# EAGLE design AniBike_v2.5_SecondaryBoard (EAGLE 5.08)

## Sheet 1 of 2
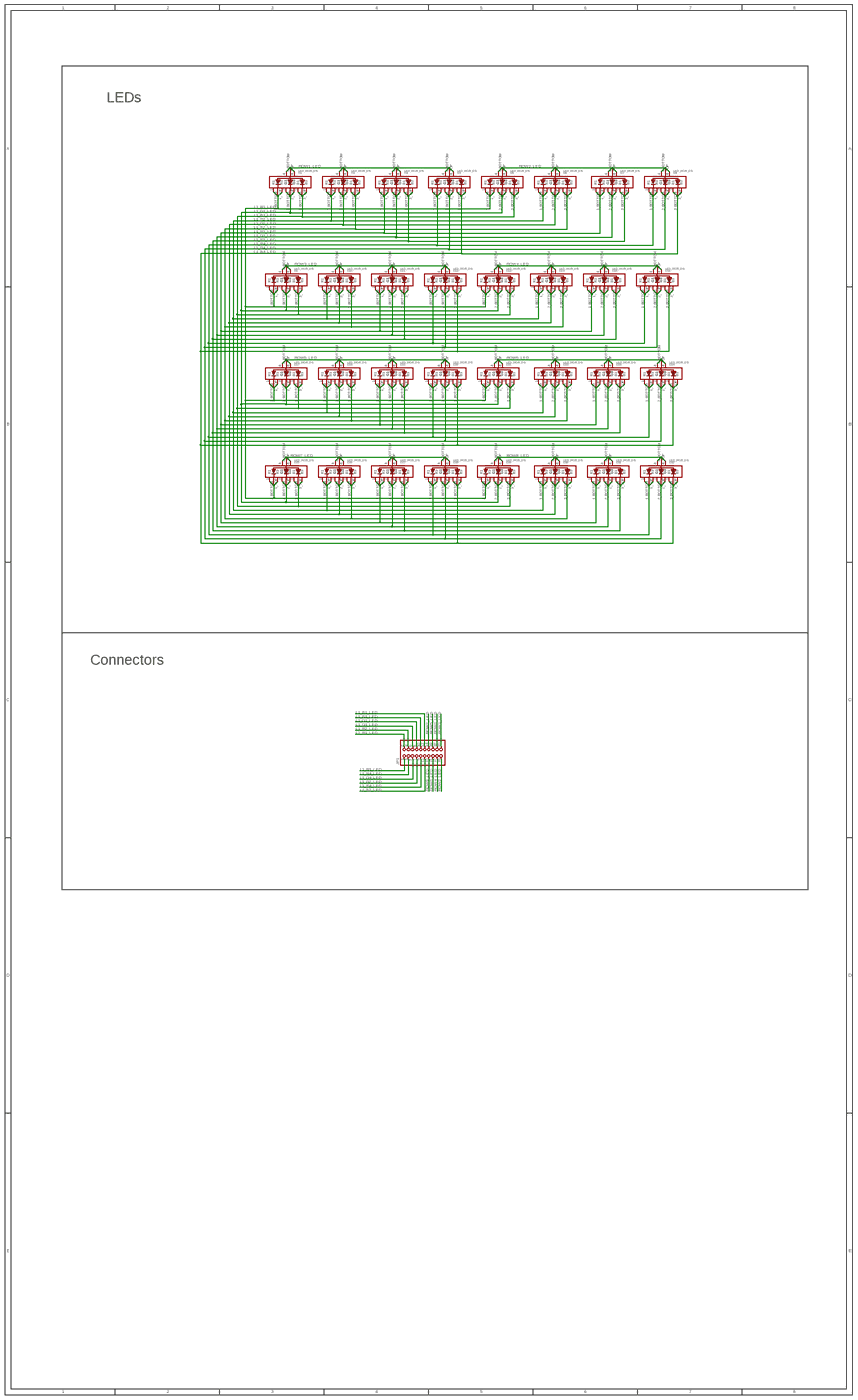
[diagram p0: schematic, sheet 1, overview]
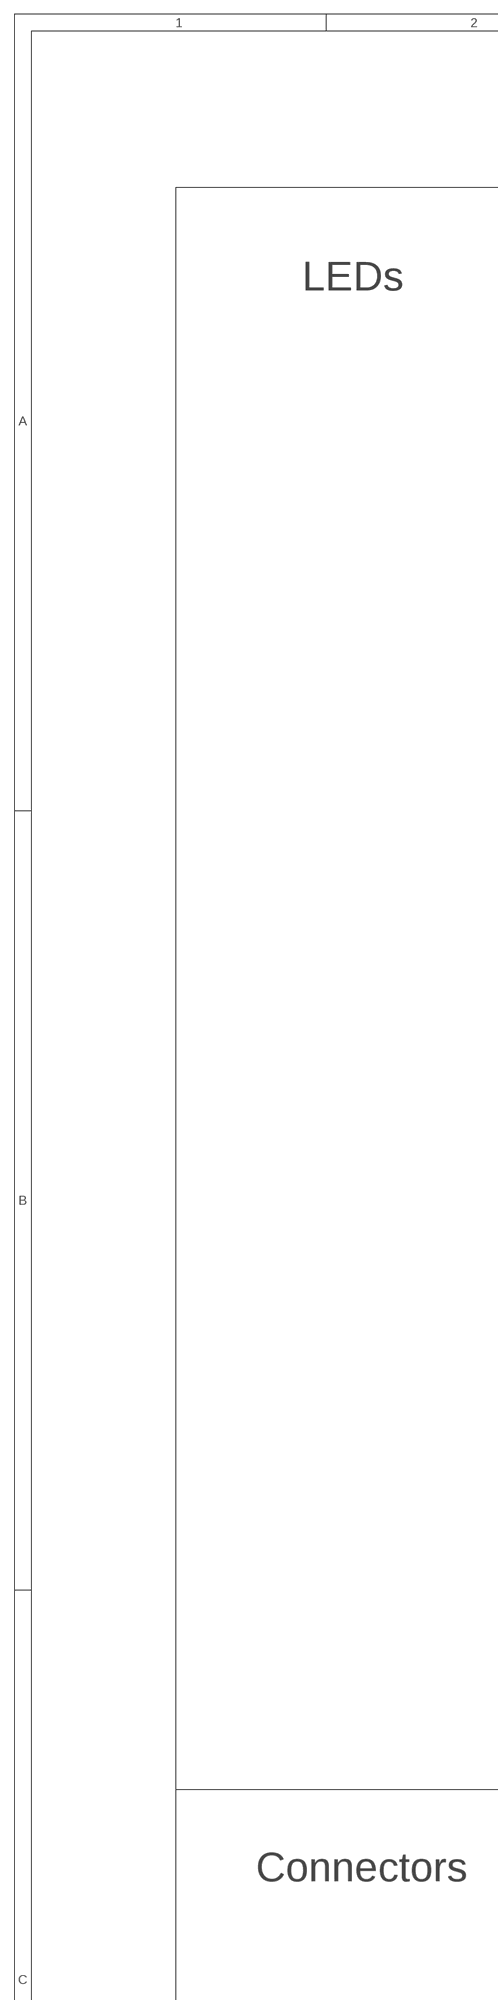
[diagram p1: schematic, sheet 1, part 1 of 4]
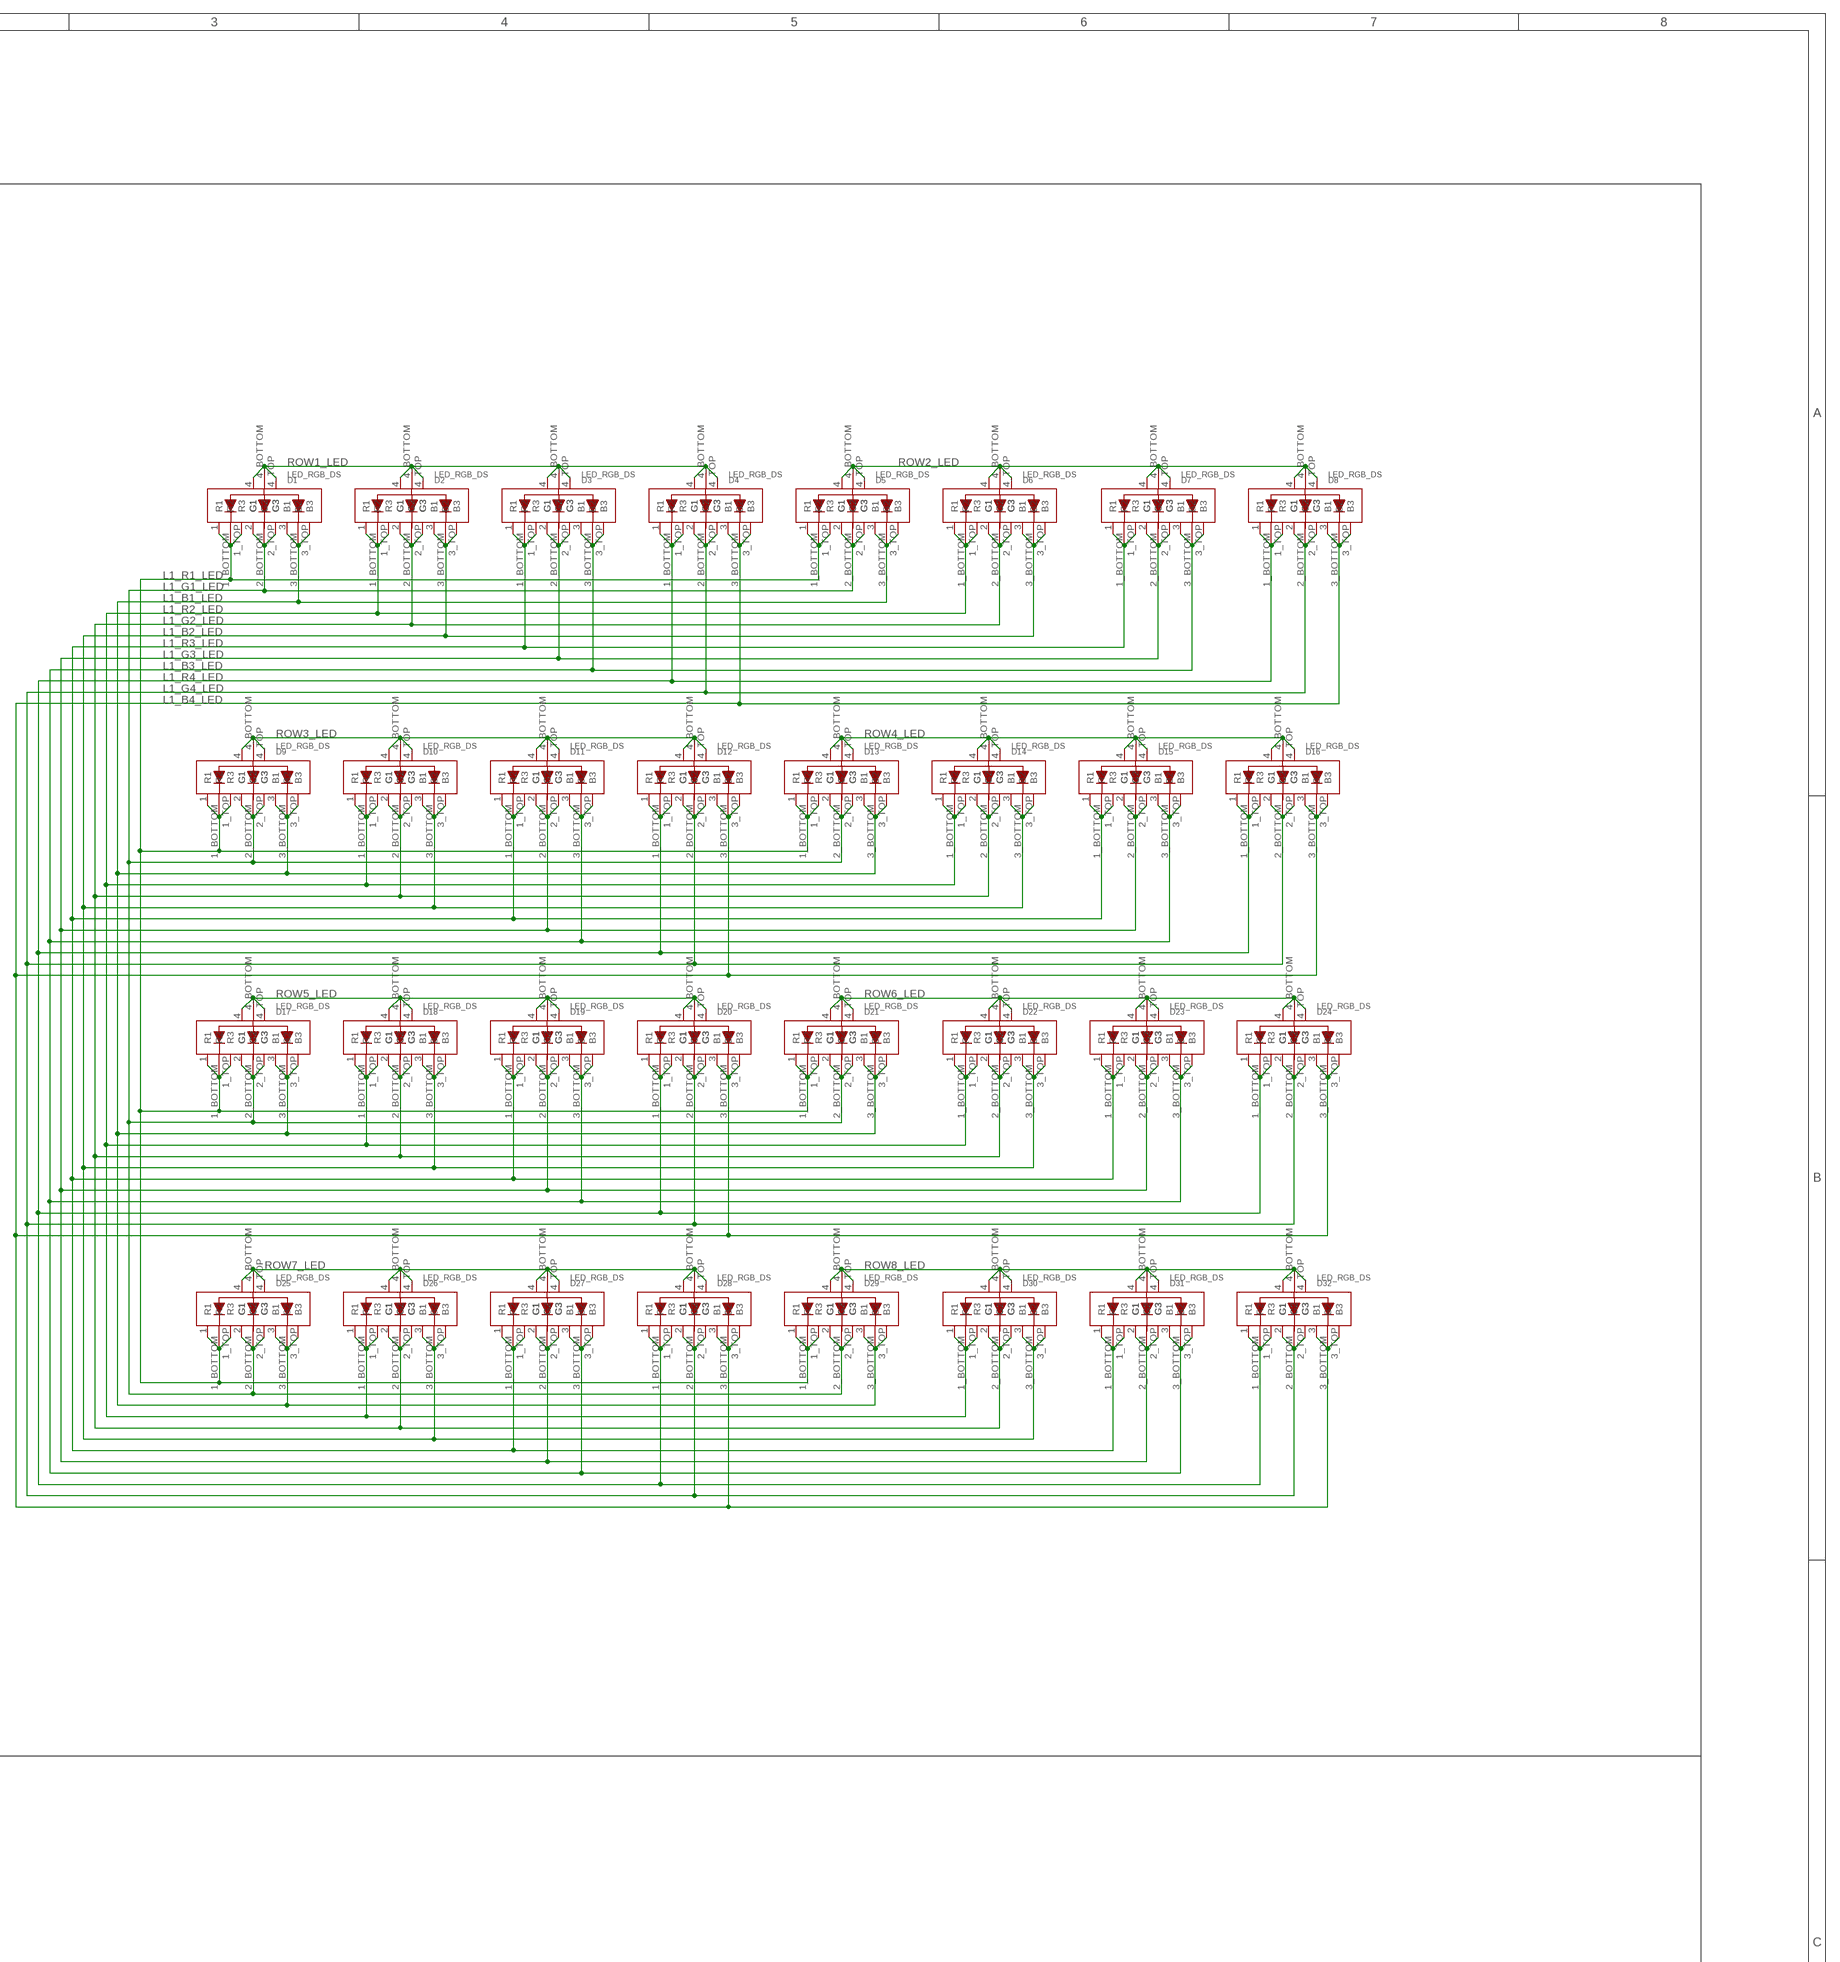
[diagram p2: schematic, sheet 1, part 2 of 4]
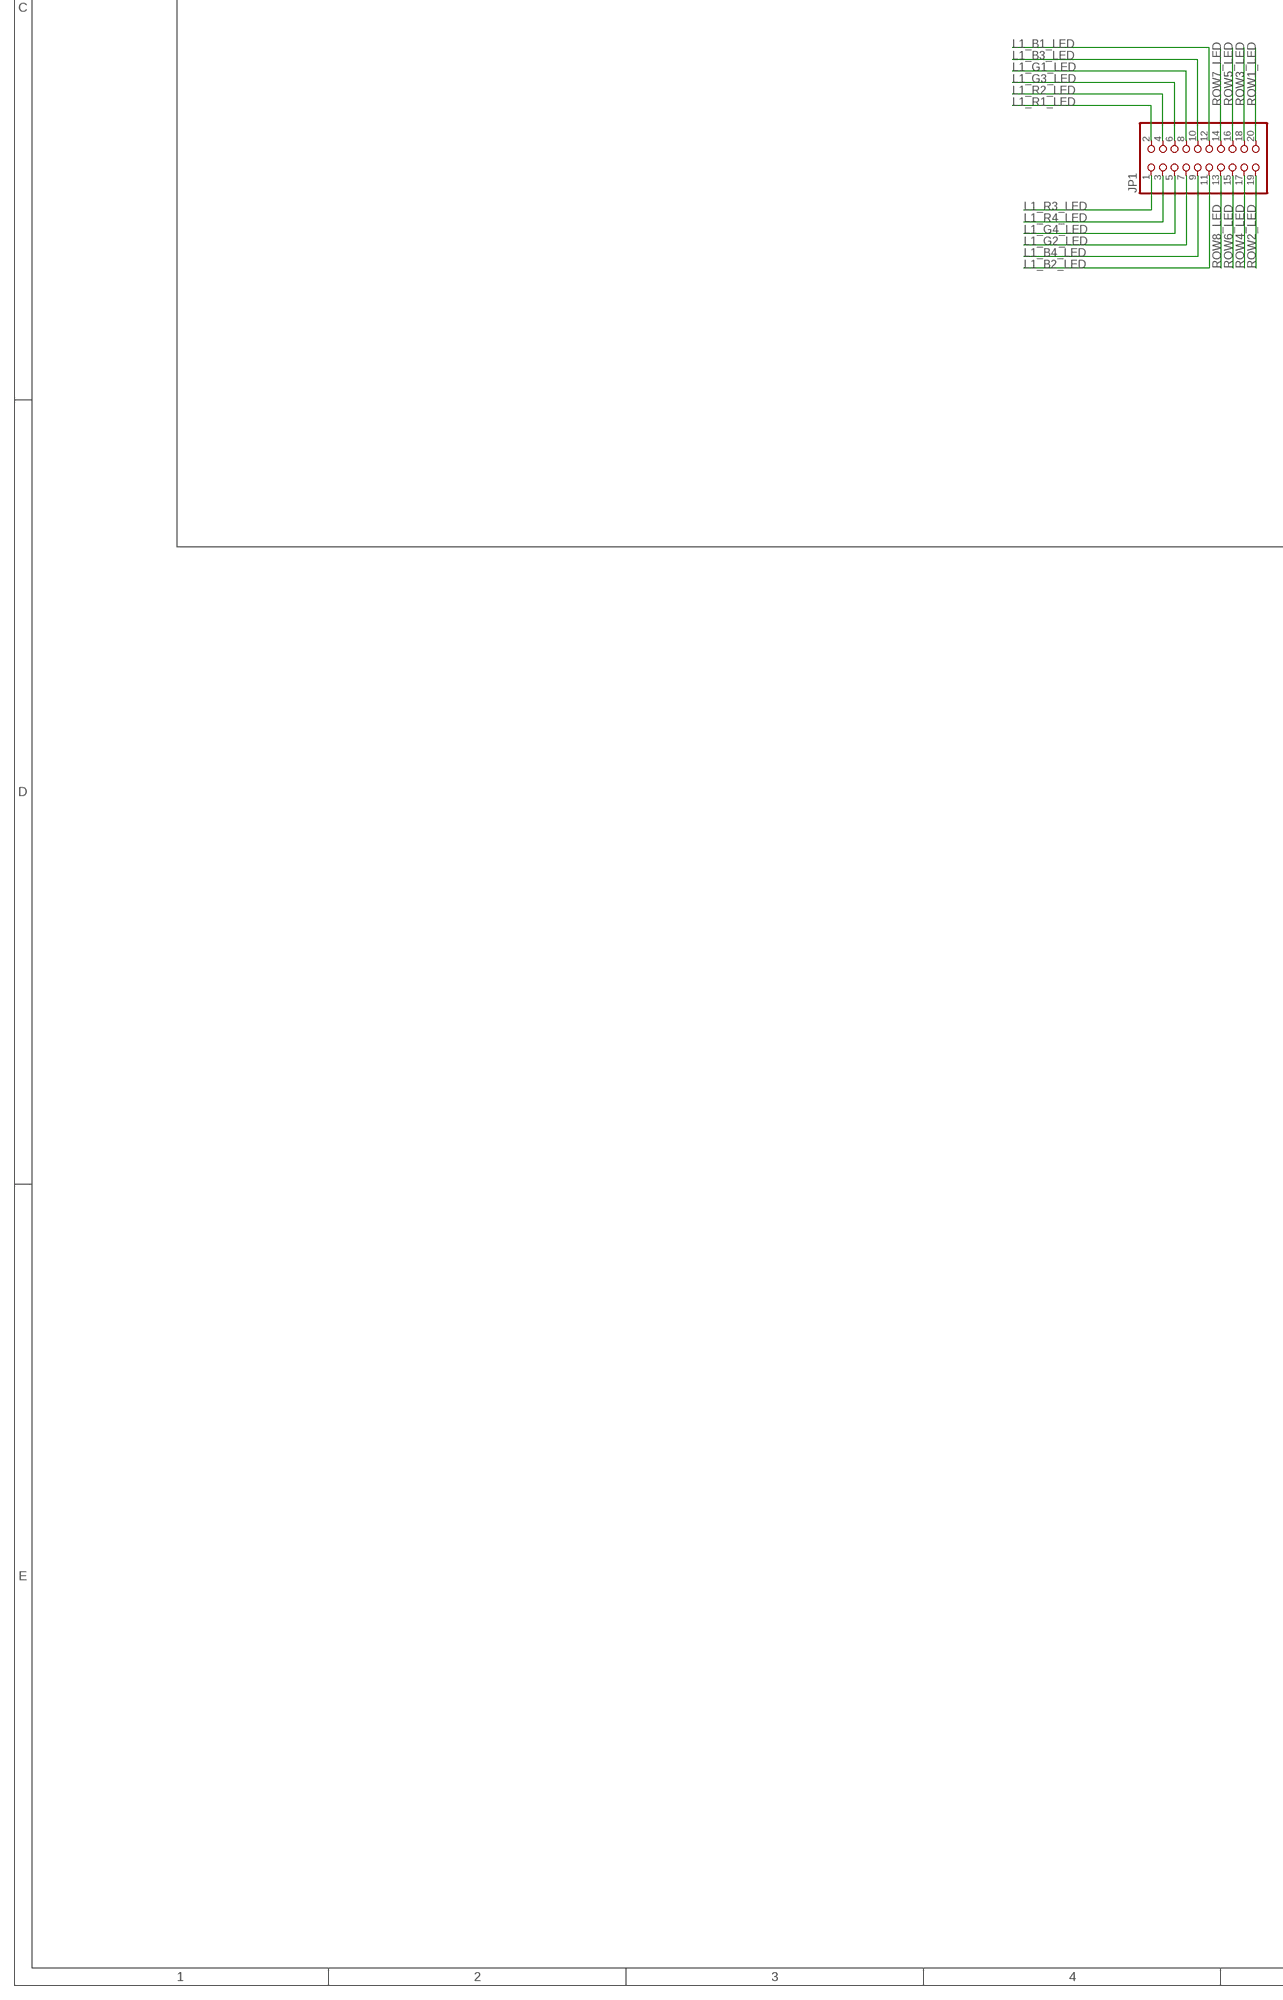
[diagram p3: schematic, sheet 1, part 3 of 4]
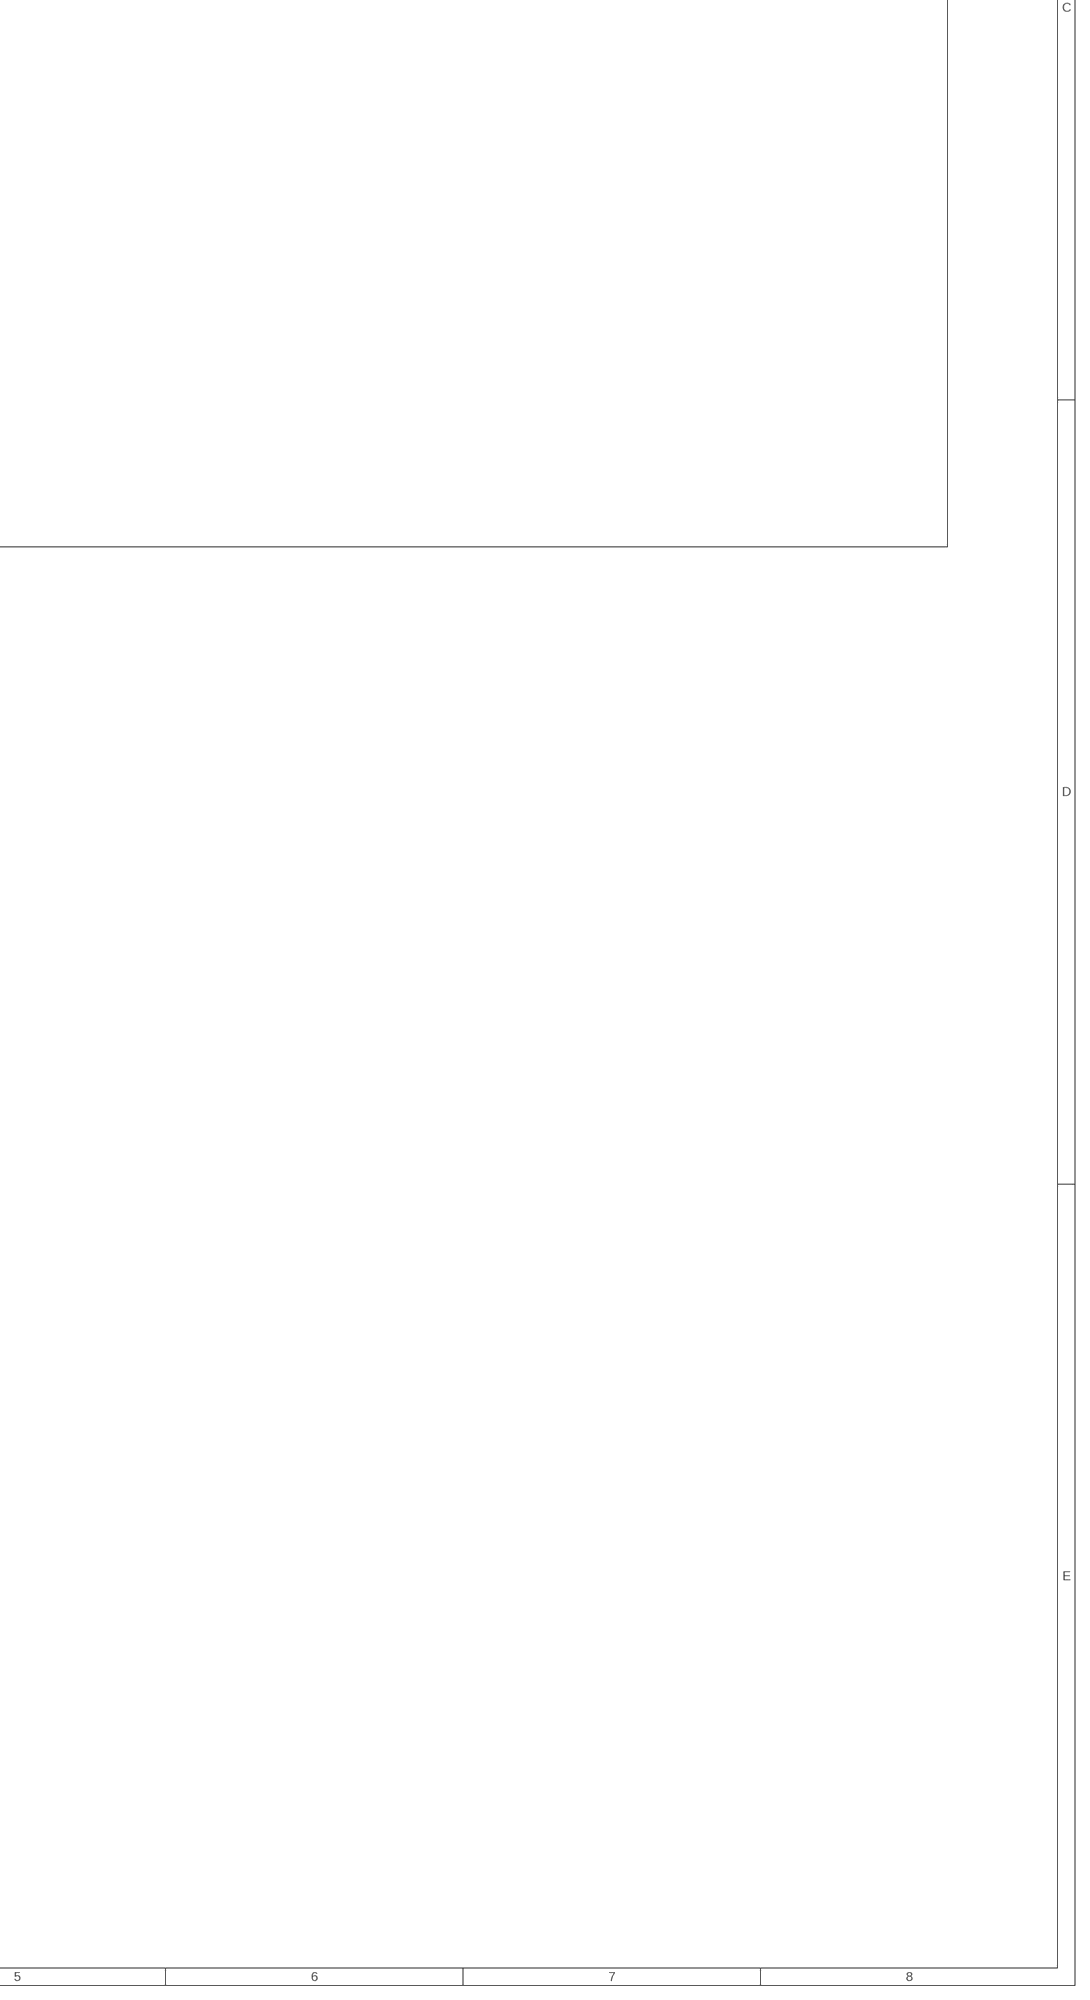
[diagram p4: schematic, sheet 1, part 4 of 4]

### Parts
D1  LED_RGB_DS  [LED1210_DS]
D2  LED_RGB_DS  [LED1210_DS]
D3  LED_RGB_DS  [LED1210_DS]
D4  LED_RGB_DS  [LED1210_DS]
D5  LED_RGB_DS  [LED1210_DS]
D6  LED_RGB_DS  [LED1210_DS]
D7  LED_RGB_DS  [LED1210_DS]
D8  LED_RGB_DS  [LED1210_DS]
D9  LED_RGB_DS  [LED1210_DS]
D10  LED_RGB_DS  [LED1210_DS]
D11  LED_RGB_DS  [LED1210_DS]
D12  LED_RGB_DS  [LED1210_DS]
D13  LED_RGB_DS  [LED1210_DS]
D14  LED_RGB_DS  [LED1210_DS]
D15  LED_RGB_DS  [LED1210_DS]
D16  LED_RGB_DS  [LED1210_DS]
D17  LED_RGB_DS  [LED1210_DS]
D18  LED_RGB_DS  [LED1210_DS]
D19  LED_RGB_DS  [LED1210_DS]
D20  LED_RGB_DS  [LED1210_DS]
D21  LED_RGB_DS  [LED1210_DS]
D22  LED_RGB_DS  [LED1210_DS]
D23  LED_RGB_DS  [LED1210_DS]
D24  LED_RGB_DS  [LED1210_DS]
D25  LED_RGB_DS  [LED1210_DS]
D26  LED_RGB_DS  [LED1210_DS]
D27  LED_RGB_DS  [LED1210_DS]
D28  LED_RGB_DS  [LED1210_DS]
D29  LED_RGB_DS  [LED1210_DS]
D30  LED_RGB_DS  [LED1210_DS]
D31  LED_RGB_DS  [LED1210_DS]
D32  LED_RGB_DS  [LED1210_DS]
JP1  PINHD-2X10  [2X10]

### Nets
L1_B1_LED: D1.3(B1) D1.3_BOTTOM(B2) D1.3_TOP(B3) D5.3(B1) D5.3_BOTTOM(B2) D5.3_TOP(B3) D9.3(B1) D9.3_BOTTOM(B2) D9.3_TOP(B3) D13.3(B1) D13.3_BOTTOM(B2) D13.3_TOP(B3) D17.3(B1) D17.3_BOTTOM(B2) D17.3_TOP(B3) D21.3(B1) D21.3_BOTTOM(B2) D21.3_TOP(B3) D25.3(B1) D25.3_BOTTOM(B2) D25.3_TOP(B3) D29.3(B1) D29.3_BOTTOM(B2) D29.3_TOP(B3) JP1.12
L1_B2_LED: D2.3(B1) D2.3_BOTTOM(B2) D2.3_TOP(B3) D6.3(B1) D6.3_BOTTOM(B2) D6.3_TOP(B3) D10.3(B1) D10.3_BOTTOM(B2) D10.3_TOP(B3) D14.3(B1) D14.3_BOTTOM(B2) D14.3_TOP(B3) D18.3(B1) D18.3_BOTTOM(B2) D18.3_TOP(B3) D22.3(B1) D22.3_BOTTOM(B2) D22.3_TOP(B3) D26.3(B1) D26.3_BOTTOM(B2) D26.3_TOP(B3) D30.3(B1) D30.3_BOTTOM(B2) D30.3_TOP(B3) JP1.11
L1_B3_LED: D3.3(B1) D3.3_BOTTOM(B2) D3.3_TOP(B3) D7.3(B1) D7.3_BOTTOM(B2) D7.3_TOP(B3) D11.3(B1) D11.3_BOTTOM(B2) D11.3_TOP(B3) D15.3(B1) D15.3_BOTTOM(B2) D15.3_TOP(B3) D19.3(B1) D19.3_BOTTOM(B2) D19.3_TOP(B3) D23.3(B1) D23.3_BOTTOM(B2) D23.3_TOP(B3) D27.3(B1) D27.3_BOTTOM(B2) D27.3_TOP(B3) D31.3(B1) D31.3_BOTTOM(B2) D31.3_TOP(B3) JP1.10
L1_B4_LED: D4.3(B1) D4.3_BOTTOM(B2) D4.3_TOP(B3) D8.3(B1) D8.3_BOTTOM(B2) D8.3_TOP(B3) D12.3(B1) D12.3_BOTTOM(B2) D12.3_TOP(B3) D16.3(B1) D16.3_BOTTOM(B2) D16.3_TOP(B3) D20.3(B1) D20.3_BOTTOM(B2) D20.3_TOP(B3) D24.3(B1) D24.3_BOTTOM(B2) D24.3_TOP(B3) D28.3(B1) D28.3_BOTTOM(B2) D28.3_TOP(B3) D32.3(B1) D32.3_BOTTOM(B2) D32.3_TOP(B3) JP1.9
L1_G1_LED: D1.2(G1) D1.2_BOTTOM(G2) D1.2_TOP(G3) D5.2(G1) D5.2_BOTTOM(G2) D5.2_TOP(G3) D9.2(G1) D9.2_BOTTOM(G2) D9.2_TOP(G3) D13.2(G1) D13.2_BOTTOM(G2) D13.2_TOP(G3) D17.2(G1) D17.2_BOTTOM(G2) D17.2_TOP(G3) D21.2(G1) D21.2_BOTTOM(G2) D21.2_TOP(G3) D25.2(G1) D25.2_BOTTOM(G2) D25.2_TOP(G3) D29.2(G1) D29.2_BOTTOM(G2) D29.2_TOP(G3) JP1.8
L1_G2_LED: D2.2(G1) D2.2_BOTTOM(G2) D2.2_TOP(G3) D6.2(G1) D6.2_BOTTOM(G2) D6.2_TOP(G3) D10.2(G1) D10.2_BOTTOM(G2) D10.2_TOP(G3) D14.2(G1) D14.2_BOTTOM(G2) D14.2_TOP(G3) D18.2(G1) D18.2_BOTTOM(G2) D18.2_TOP(G3) D22.2(G1) D22.2_BOTTOM(G2) D22.2_TOP(G3) D26.2(G1) D26.2_BOTTOM(G2) D26.2_TOP(G3) D30.2(G1) D30.2_BOTTOM(G2) D30.2_TOP(G3) JP1.7
L1_G3_LED: D3.2(G1) D3.2_BOTTOM(G2) D3.2_TOP(G3) D7.2(G1) D7.2_BOTTOM(G2) D7.2_TOP(G3) D11.2(G1) D11.2_BOTTOM(G2) D11.2_TOP(G3) D15.2(G1) D15.2_BOTTOM(G2) D15.2_TOP(G3) D19.2(G1) D19.2_BOTTOM(G2) D19.2_TOP(G3) D23.2(G1) D23.2_BOTTOM(G2) D23.2_TOP(G3) D27.2(G1) D27.2_BOTTOM(G2) D27.2_TOP(G3) D31.2(G1) D31.2_BOTTOM(G2) D31.2_TOP(G3) JP1.6
L1_G4_LED: D4.2(G1) D4.2_BOTTOM(G2) D4.2_TOP(G3) D8.2(G1) D8.2_BOTTOM(G2) D8.2_TOP(G3) D12.2(G1) D12.2_BOTTOM(G2) D12.2_TOP(G3) D16.2(G1) D16.2_BOTTOM(G2) D16.2_TOP(G3) D20.2(G1) D20.2_BOTTOM(G2) D20.2_TOP(G3) D24.2(G1) D24.2_BOTTOM(G2) D24.2_TOP(G3) D28.2(G1) D28.2_BOTTOM(G2) D28.2_TOP(G3) D32.2(G1) D32.2_BOTTOM(G2) D32.2_TOP(G3) JP1.5
L1_R1_LED: D1.1(R1) D1.1_BOTTOM(R2) D1.1_TOP(R3) D5.1(R1) D5.1_BOTTOM(R2) D5.1_TOP(R3) D9.1(R1) D9.1_BOTTOM(R2) D9.1_TOP(R3) D13.1(R1) D13.1_BOTTOM(R2) D13.1_TOP(R3) D17.1(R1) D17.1_BOTTOM(R2) D17.1_TOP(R3) D21.1(R1) D21.1_BOTTOM(R2) D21.1_TOP(R3) D25.1(R1) D25.1_BOTTOM(R2) D25.1_TOP(R3) D29.1(R1) D29.1_BOTTOM(R2) D29.1_TOP(R3) JP1.2
L1_R2_LED: D2.1(R1) D2.1_BOTTOM(R2) D2.1_TOP(R3) D6.1(R1) D6.1_BOTTOM(R2) D6.1_TOP(R3) D10.1(R1) D10.1_BOTTOM(R2) D10.1_TOP(R3) D14.1(R1) D14.1_BOTTOM(R2) D14.1_TOP(R3) D18.1(R1) D18.1_BOTTOM(R2) D18.1_TOP(R3) D22.1(R1) D22.1_BOTTOM(R2) D22.1_TOP(R3) D26.1(R1) D26.1_BOTTOM(R2) D26.1_TOP(R3) D30.1(R1) D30.1_BOTTOM(R2) D30.1_TOP(R3) JP1.4
L1_R3_LED: D3.1(R1) D3.1_BOTTOM(R2) D3.1_TOP(R3) D7.1(R1) D7.1_BOTTOM(R2) D7.1_TOP(R3) D11.1(R1) D11.1_BOTTOM(R2) D11.1_TOP(R3) D15.1(R1) D15.1_BOTTOM(R2) D15.1_TOP(R3) D19.1(R1) D19.1_BOTTOM(R2) D19.1_TOP(R3) D23.1(R1) D23.1_BOTTOM(R2) D23.1_TOP(R3) D27.1(R1) D27.1_BOTTOM(R2) D27.1_TOP(R3) D31.1(R1) D31.1_BOTTOM(R2) D31.1_TOP(R3) JP1.1
L1_R4_LED: D4.1(R1) D4.1_BOTTOM(R2) D4.1_TOP(R3) D8.1(R1) D8.1_BOTTOM(R2) D8.1_TOP(R3) D12.1(R1) D12.1_BOTTOM(R2) D12.1_TOP(R3) D16.1(R1) D16.1_BOTTOM(R2) D16.1_TOP(R3) D20.1(R1) D20.1_BOTTOM(R2) D20.1_TOP(R3) D24.1(R1) D24.1_BOTTOM(R2) D24.1_TOP(R3) D28.1(R1) D28.1_BOTTOM(R2) D28.1_TOP(R3) D32.1(R1) D32.1_BOTTOM(R2) D32.1_TOP(R3) JP1.3
ROW1_LED: D1.4(C1) D1.4_BOTTOM(C2) D1.4_TOP(C3) D2.4(C1) D2.4_BOTTOM(C2) D2.4_TOP(C3) D3.4(C1) D3.4_BOTTOM(C2) D3.4_TOP(C3) D4.4(C1) D4.4_BOTTOM(C2) D4.4_TOP(C3) JP1.20
ROW2_LED: D5.4(C1) D5.4_BOTTOM(C2) D5.4_TOP(C3) D6.4(C1) D6.4_BOTTOM(C2) D6.4_TOP(C3) D7.4(C1) D7.4_BOTTOM(C2) D7.4_TOP(C3) D8.4(C1) D8.4_BOTTOM(C2) D8.4_TOP(C3) JP1.19
ROW3_LED: D9.4(C1) D9.4_BOTTOM(C2) D9.4_TOP(C3) D10.4(C1) D10.4_BOTTOM(C2) D10.4_TOP(C3) D11.4(C1) D11.4_BOTTOM(C2) D11.4_TOP(C3) D12.4(C1) D12.4_BOTTOM(C2) D12.4_TOP(C3) JP1.18
ROW4_LED: D13.4(C1) D13.4_BOTTOM(C2) D13.4_TOP(C3) D14.4(C1) D14.4_BOTTOM(C2) D14.4_TOP(C3) D15.4(C1) D15.4_BOTTOM(C2) D15.4_TOP(C3) D16.4(C1) D16.4_BOTTOM(C2) D16.4_TOP(C3) JP1.17
ROW5_LED: D17.4(C1) D17.4_BOTTOM(C2) D17.4_TOP(C3) D18.4(C1) D18.4_BOTTOM(C2) D18.4_TOP(C3) D19.4(C1) D19.4_BOTTOM(C2) D19.4_TOP(C3) D20.4(C1) D20.4_BOTTOM(C2) D20.4_TOP(C3) JP1.16
ROW6_LED: D21.4(C1) D21.4_BOTTOM(C2) D21.4_TOP(C3) D22.4(C1) D22.4_BOTTOM(C2) D22.4_TOP(C3) D23.4(C1) D23.4_BOTTOM(C2) D23.4_TOP(C3) D24.4(C1) D24.4_BOTTOM(C2) D24.4_TOP(C3) JP1.15
ROW7_LED: D25.4(C1) D25.4_BOTTOM(C2) D25.4_TOP(C3) D26.4(C1) D26.4_BOTTOM(C2) D26.4_TOP(C3) D27.4(C1) D27.4_BOTTOM(C2) D27.4_TOP(C3) D28.4(C1) D28.4_BOTTOM(C2) D28.4_TOP(C3) JP1.14
ROW8_LED: D29.4(C1) D29.4_BOTTOM(C2) D29.4_TOP(C3) D30.4(C1) D30.4_BOTTOM(C2) D30.4_TOP(C3) D31.4(C1) D31.4_BOTTOM(C2) D31.4_TOP(C3) D32.4(C1) D32.4_BOTTOM(C2) D32.4_TOP(C3) JP1.13

### Notes on the sheet
- LEDs
- Connectors

## Sheet 2 of 2

## Library data of the parts
D1-D32 = AniBike_Common_Library:LED_RGB_DS
JP1 = SparkFun:PINHD-2X10: PIN HEADER

## Board
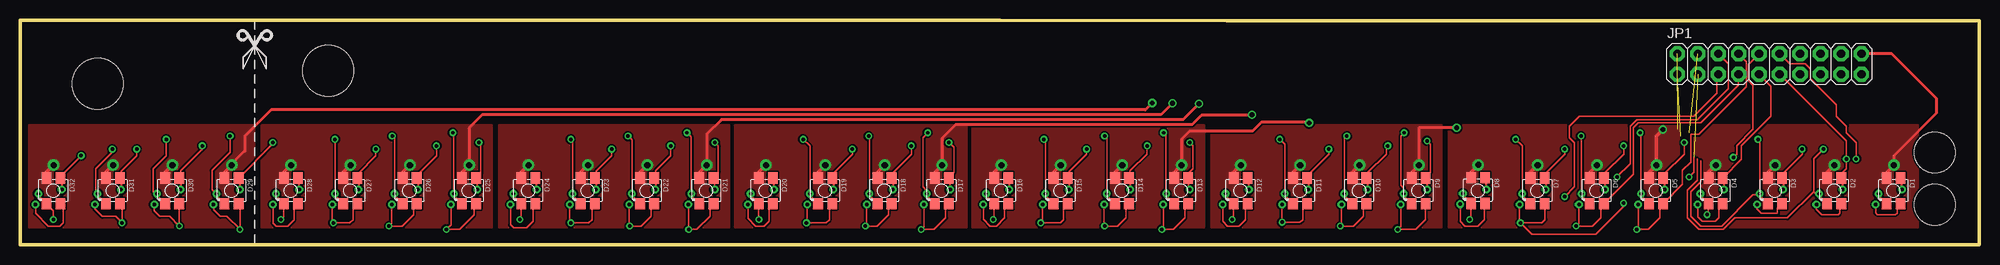
[diagram p5: board, top side]
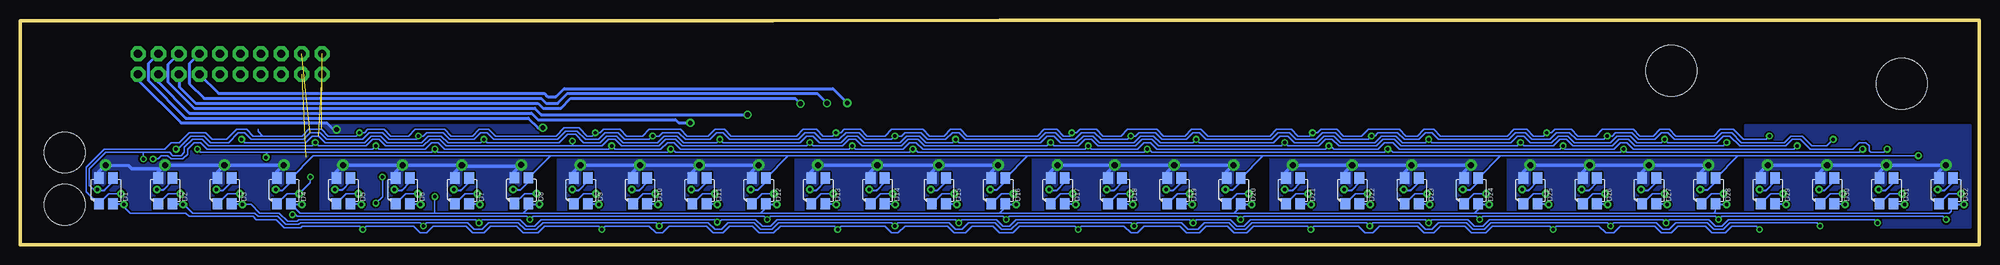
[diagram p6: board, bottom side, seen from below]

Size 243.13 x 27.84 mm. Coordinates in mm from the lower left corner, seen from the top.
Outline: 243.13,0 0,0 0,27.84 121.56,27.84 149.71,27.74 243.13,27.74 243.13,0
Copper layers (1*16): Top 0.035mm / dielectric 1.5mm / Bottom 0.035mm
Design rules "default *": minimum track width 7mil, minimum drill 15mil, track to track 8mil, track to pad 8mil, pad to pad 8mil, via to via 8mil, smd to smd 8mil, copper to edge 10mil, drill to drill 15mil, minimum pad ring 10mil, minimum via ring 8mil, stop-mask expansion 4mil, vias tented up to drill 0mil, thermal gap 10mil
Holes 6.35 mm at 9.6,19.96 38.25,21.59
Holes 5.08 mm at 237.59,4.93 237.59,11.43

### Footprints (pad centres in the part's own frame; a part is rotated, then mirrored left to right if it is on the bottom)
LED1210_DS = drill 0.432 pad 0.889 round: 1 -1.913,-0.353; 2 -2.25,-1.68; 3 1,0.15 | smd 1.2 x 1.4 bottom: 1_BOTTOM 0.85,-1.6; 2_BOTTOM -0.9,-1.6; 3_BOTTOM -0.9,1.6; 4_BOTTOM 0.85,1.6 | smd 1.2 x 1.4: 1_TOP -0.9,-1.6; 2_TOP 0.85,-1.6; 3_TOP 0.85,1.6; 4_TOP -0.9,1.6 | drill 0.762 pad 1.422 round: 4 0,3.2
2X10 = drill 1.016 pad 1.88 octagon: 1 -11.43,-1.27; 2 -11.43,1.27; 3 -8.89,-1.27; 4 -8.89,1.27; 5 -6.35,-1.27; 6 -6.35,1.27; 7 -3.81,-1.27; 8 -3.81,1.27; 9 -1.27,-1.27; 10 -1.27,1.27; 11 1.27,-1.27; 12 1.27,1.27; 13 3.81,-1.27; 14 3.81,1.27; 15 6.35,-1.27; 16 6.35,1.27; 17 8.89,-1.27; 18 8.89,1.27; 19 11.43,-1.27; 20 11.43,1.27

### Placement (x,y rotation side)
D1  232.51,6.65 0 top
D2  225.15,6.65 0 top
D3  217.78,6.65 0 top
D4  210.41,6.65 0 top
D5  203.05,6.65 0 top
D6  195.68,6.65 0 top
D7  188.32,6.65 0 top
D8  180.95,6.68 0 top
D9  173.58,6.65 0 top
D10  166.22,6.65 0 top
D11  158.85,6.65 0 top
D12  151.49,6.65 0 top
D13  144.12,6.65 0 top
D14  136.75,6.65 0 top
D15  129.13,6.65 0 top
D16  121.77,6.65 0 top
D17  114.4,6.65 0 top
D18  107.29,6.65 0 top
D19  99.92,6.65 0 top
D20  92.56,6.65 0 top
D21  85.19,6.65 0 top
D22  77.83,6.65 0 top
D23  70.46,6.65 0 top
D24  63.09,6.65 0 top
D25  55.73,6.65 0 top
D26  48.36,6.65 0 top
D27  41,6.65 0 top
D28  33.63,6.65 0 top
D29  26.26,6.65 0 top
D30  18.9,6.65 0 top
D31  11.53,6.65 0 top
D32  4.17,6.65 0 top
JP1  217.07,22.4 0 top

### Tracks (layer width: path | path; a pad name or v marks a point on that pad's centre or on a via)
L1_B1_LED  (via drill 0.43)
  Top 0.203: 204.05,8.1 204.05,8.77 206.5,11.23 v206.5,12.65 | D29.3_TOP 31.34,12.48 v31.34,12.65 | v56.95,12.65 57.15,12.45 57.15,8.79 56.62,8.25 D25.3_TOP 56.73,8.1 D25.3 | v86.21,12.65 86.61,12.24 86.61,8.99 86.04,8.42 D21.3_TOP 86.19,8.1 D21.3 | v115.26,12.65 115.87,12.04 115.87,8.99 115.25,8.37 D17.3_TOP 115.4,8.1 D17.3 | v145.14,12.65 145.54,12.24 145.54,9.4 144.97,8.83 D13.3_TOP 144.97,6.95 D13.3 | v174.6,12.85 175.01,12.45 175.01,8.99 174.43,8.42 D9.3_TOP | D1.3_TOP 233.4,8.25 | v227.84,10.62 227.84,12.65 226.62,13.87 226.62,14.68 225.4,15.9 225.4,17.32 222.15,20.57 222.15,21.79 221.54,22.4 219.61,22.4 JP1.12
  Top 0.254: D1.3 233.51,8.1 D1.3_TOP | D5.3 204.05,8.1 D5.3_TOP | D9.3 174.58,8.1 D9.3_TOP | D29.3_TOP 27.26,8.1 D29.3
  Bottom 0.203: v31.34,12.65 31.75,12.24 42.72,12.24 43.54,13.06 44.75,13.06 45.57,12.24 50.44,12.24 51.26,13.06 52.07,13.06 52.88,12.24 56.54,12.24 v56.95,12.65 57.35,12.24 71.78,12.24 72.59,13.06 74.02,13.06 74.83,12.24 79.5,12.24 80.31,13.06 81.13,13.06 81.94,12.24 85.8,12.24 v86.21,12.65 86.61,12.24 101.85,12.24 102.67,13.06 103.89,13.06 104.7,12.24 109.37,12.24 110.18,13.06 111,13.06 111.81,12.24 114.86,12.24 v115.26,12.65 115.67,12.24 130.91,12.24 131.72,13.06 132.94,13.06 133.76,12.24 138.63,12.24 139.45,13.06 140.26,13.06 141.07,12.24 144.73,12.24 v145.14,12.65 145.54,12.24 160.98,12.24 161.8,13.06 163.02,13.06 163.83,12.24 168.5,12.24 169.32,13.06 170.13,13.06 170.94,12.24 174.6,12.24 | 174.6,12.24 v174.6,12.85 | 174.6,12.24 190.25,12.24 191.06,13.06 192.28,13.06 193.09,12.24 197.76,12.24 198.58,13.06 199.39,13.06 200.2,12.24 206.1,12.24 v206.5,12.65 206.91,12.24 219.71,12.24 220.52,13.06 221.74,13.06 222.76,12.04 222.76,11.43 223.16,11.02 224.18,11.02 224.59,11.43 227.84,11.43 | 227.84,11.43 232.51,11.43 234.54,9.4 234.54,7.37 233.98,6.8 D1.3 | 227.84,11.43 v227.84,10.62
  Bottom 0.254: D1.3_BOTTOM 231.61,7.78 232.69,6.71 233.41,6.71 D1.3 | D5.3_BOTTOM 202.15,7.78 203.12,6.81 D5.3 | D9.3_BOTTOM 172.68,7.86 173.79,6.76 174.53,6.76 D9.3 | D13.3_BOTTOM 143.22,7.86 144.32,6.76 145.07,6.76 D13.3 | D17.3_BOTTOM 113.5,7.71 114.45,6.76 115.35,6.76 D17.3 | D21.3_BOTTOM 84.29,7.66 85.19,6.76 86.14,6.76 D21.3 | D25.3_BOTTOM 54.83,7.86 55.93,6.76 56.68,6.76 D25.3 | D29.3_BOTTOM 25.36,7.86 26.47,6.76 27.21,6.76 D29.3
L1_B2_LED  (via drill 0.43)
  Top 0.203: 19.9,8.1 19.9,9.13 22.61,11.84 v22.61,12.24 | 49.36,8.1 49.36,8.72 51.66,11.02 v51.66,12.24 | 78.83,8.1 78.83,9.13 80.72,11.02 v80.72,12.24 | 108.29,8.1 108.29,8.92 110.59,11.23 v110.59,12.24 | 137.75,8.1 137.75,9.13 139.85,11.23 v139.85,12.24 | 167.22,8.1 167.22,8.92 169.52,11.23 169.52,12.04 v169.72,12.24 | 196.68,8.1 196.68,8.92 198.98,11.23 v198.98,12.24 | 226.15,8.92 226.62,9.4 v226.62,10.62 226.62,12.85 JP1.11
  Top 0.254: 226.15,8.1 D2.3 | 226.15,8.1 D2.3_TOP | D6.3 196.68,8.1 D6.3_TOP | D10.3 167.22,8.1 D10.3_TOP | D14.3 137.75,8.1 D14.3_TOP | D18.3 108.29,8.1 D18.3_TOP | D22.3 78.83,8.1 D22.3_TOP | D26.3 49.36,8.1 D26.3_TOP | D30.3 19.9,8.1 D30.3_TOP | 226.15,8.92 226.15,8.1
  Bottom 0.203: v22.61,12.24 23.01,11.84 42.93,11.84 43.74,12.65 44.55,12.65 45.36,11.84 51.46,11.84 51.66,12.04 v51.66,12.24 52.07,11.84 71.98,11.84 72.8,12.65 73.81,12.65 74.62,11.84 80.11,11.84 80.52,12.24 v80.72,12.24 81.13,11.84 102.06,11.84 102.87,12.65 103.68,12.65 104.5,11.84 110.18,11.84 v110.59,12.24 111,11.84 131.11,11.84 131.93,12.65 132.74,12.65 133.55,11.84 139.45,11.84 v139.85,12.24 140.26,11.84 161.19,11.84 162,12.65 162.81,12.65 163.63,11.84 169.32,11.84 v169.72,12.24 170.13,11.84 190.45,11.84 191.26,12.65 192.07,12.65 192.89,11.84 198.58,11.84 v198.98,12.24 199.39,11.84 219.91,11.84 220.73,12.65 221.54,12.65 222.35,11.84 222.35,11.23 222.96,10.62 224.38,10.62 224.79,11.02 225.6,11.02 226.01,10.62 v226.62,10.62
  Bottom 0.254: D2.3_BOTTOM 224.25,7.89 225.32,6.81 D2.3 | D6.3_BOTTOM 194.78,7.71 195.73,6.76 196.63,6.76 D6.3 | D10.3_BOTTOM 165.32,7.71 166.27,6.76 167.17,6.76 D10.3 | D14.3_BOTTOM 135.85,7.71 136.8,6.76 137.7,6.76 D14.3 | D18.3_BOTTOM 106.39,7.71 107.34,6.76 108.24,6.76 D18.3 | D22.3_BOTTOM 76.93,7.71 77.88,6.76 78.78,6.76 D22.3 | D26.3_BOTTOM 47.46,7.71 48.41,6.76 49.31,6.76 D26.3 | D30.3_BOTTOM 18,7.91 19.15,6.76 19.85,6.76 D30.3
L1_B3_LED  (via drill 0.43)
  Top 0.203: 12.53,8.1 12.53,9.08 14.48,11.02 v14.48,11.84 | 42,8.1 42,8.87 44.14,11.02 v44.14,11.84 | 71.46,8.1 71.46,9.08 73.41,11.02 v73.41,11.84 | 100.92,8.1 100.92,8.87 103.28,11.23 v103.28,11.84 | 130.13,8.1 130.13,9.03 132.33,11.23 v132.33,11.84 | 159.85,8.1 159.85,8.67 162.41,11.23 v162.41,11.84 | 189.32,8.1 189.32,8.87 191.67,11.23 v191.67,11.84 | 218.78,8.1 218.78,8.87 221.13,11.23 v221.13,11.84 | v212.6,10.82 213,11.23 213,12.24 215.04,14.27 215.04,19.76 214.43,20.37 214.43,22.3 JP1.10
  Top 0.254: D3.3 218.78,8.1 D3.3_TOP | D7.3 189.32,8.1 D7.3_TOP | D11.3 159.85,8.1 D11.3_TOP | D15.3 130.13,8.1 D15.3_TOP | D19.3 100.92,8.1 D19.3_TOP | D23.3 71.46,8.1 D23.3_TOP | D27.3 42,8.1 D27.3_TOP | D31.3 12.53,8.1 D31.3_TOP
  Bottom 0.203: v14.48,11.84 14.88,11.43 43.74,11.43 v44.14,11.84 44.55,11.43 72.8,11.43 73.2,11.84 v73.41,11.84 73.81,11.43 102.67,11.43 103.07,11.84 v103.28,11.84 103.68,11.43 131.72,11.43 132.13,11.84 v132.33,11.84 132.74,11.43 161.8,11.43 162.2,11.84 v162.41,11.84 162.81,11.43 191.26,11.43 v191.67,11.84 192.07,11.43 212.39,11.43 | 212.39,11.43 220.73,11.43 v221.13,11.84 | v212.6,10.82 212.6,11.23 212.39,11.43
  Bottom 0.254: D3.3_BOTTOM 216.88,7.78 217.96,6.71 218.68,6.71 D3.3 | D7.3_BOTTOM 187.42,7.76 188.42,6.76 189.27,6.76 D7.3 | D11.3_BOTTOM 157.95,7.76 158.95,6.76 159.8,6.76 D11.3 | D15.3_BOTTOM 128.23,7.81 129.29,6.76 130.08,6.76 D15.3 | D19.3_BOTTOM 99.02,7.76 100.02,6.76 100.87,6.76 D19.3 | D23.3_BOTTOM 69.56,7.76 70.56,6.76 71.41,6.76 D23.3 | D27.3_BOTTOM 40.1,7.76 41.1,6.76 41.95,6.76 D27.3 | D31.3_BOTTOM 10.63,7.76 11.63,6.76 12.48,6.76 D31.3
L1_B4_LED  (via drill 0.43)
  Top 0.203: 5.17,8.1 5.17,8.62 v7.57,11.02 | D4.3_TOP 213.61,10.61 213.61,12.24 217.27,15.9 217.27,19.66 JP1.9
  Top 0.254: D4.3 211.41,8.1 D4.3_TOP | D8.3 181.95,8.13 D8.3_TOP | D12.3 152.49,8.1 D12.3_TOP | D16.3 122.77,8.1 D16.3_TOP | D20.3 93.56,8.1 D20.3_TOP | D24.3 64.09,8.1 D24.3_TOP | D32.3 5.17,8.1 D32.3_TOP | D28.3_TOP 34.63,8.1 D28.3
  Bottom 0.203: 29.96,11.02 v7.57,11.02 | 29.96,11.02 D28.3_BOTTOM | 59.42,11.02 29.96,11.02 | 59.42,11.02 D24.3_BOTTOM | 88.89,11.02 59.42,11.02 | 88.89,11.02 D20.3_BOTTOM | 118.1,11.02 88.89,11.02 | 118.1,11.02 D16.3_BOTTOM | 147.82,11.02 118.1,11.02 | 147.82,11.02 D12.3_BOTTOM | 177.31,11.02 147.82,11.02 | 177.31,11.02 D8.3_BOTTOM | 177.31,11.02 206.74,11.02 D4.3_BOTTOM
  Bottom 0.254: D4.3_BOTTOM 209.51,7.78 210.54,6.76 211.36,6.76 D4.3 | D8.3_BOTTOM 180.05,7.81 181.1,6.76 181.88,6.76 D8.3 | D12.3_BOTTOM 150.59,7.81 151.64,6.76 152.44,6.76 D12.3 | D16.3_BOTTOM 120.87,7.86 121.97,6.76 122.72,6.76 D16.3 | D20.3_BOTTOM 91.66,7.81 92.71,6.76 93.51,6.76 D20.3 | D24.3_BOTTOM 62.19,7.81 63.25,6.76 64.04,6.76 D24.3 | D28.3_BOTTOM 32.73,7.81 33.78,6.76 34.58,6.76 D28.3 | D32.3_BOTTOM 3.27,7.81 4.32,6.76 5.12,6.76 D32.3
L1_G1_LED  (via drill 0.43)
  Top 0.203: 27.18,5.23 27.28,5.13 v27.28,1.88 25.65,3.51 24.84,3.51 24.01,4.33 D29.2 | 27.18,5.23 27.11,5.3 | D25.2 53.48,2.47 v52.88,1.88 54.51,1.88 56.34,3.71 56.34,4.81 D25.2_TOP | D21.2 82.94,1.89 v82.96,1.88 83.97,1.88 85.6,3.51 85.6,4.61 D21.2_TOP | D17.2 112.15,2.22 v111.81,1.88 113.44,1.88 114.86,3.3 114.86,4.66 D17.2_TOP | D13.2 141.87,2.07 v141.68,1.88 143.1,1.88 144.53,3.3 144.53,4.61 D13.2_TOP | D9.2 171.33,2.27 v170.94,1.88 173.18,1.88 174.4,3.1 174.4,5.02 D9.2_TOP | D5.2 200.8,2.07 v200.61,1.88 202.03,1.88 203.45,3.3 203.45,4.61 D5.2_TOP 206.3,7.46 206.3,9.19 207.31,10.21 207.31,13.67 208.33,13.67 214.22,19.56 214.22,22.71 JP1.8 | D1.2_TOP 232.92,4.61 232.92,3.91 232.71,3.71 230.48,3.71 230.26,3.93 D1.2 | D29.2_TOP 27.11,5.17 27.18,5.23
  Bottom 0.203: v27.28,1.88 27.69,2.29 30.73,2.29 31.55,1.47 33.17,1.47 33.98,2.29 37.44,2.29 38.25,1.47 39.47,1.47 40.28,2.29 44.55,2.29 45.36,1.47 46.38,1.47 47.19,2.29 52.48,2.29 v52.88,1.88 53.29,2.29 60.4,2.29 61.21,1.47 63.04,1.47 63.86,2.29 66.9,2.29 67.72,1.47 68.94,1.47 69.75,2.29 74.42,2.29 75.23,1.47 76.25,1.47 77.06,2.29 82.55,2.29 v82.96,1.88 83.36,2.29 90.07,2.29 90.88,1.47 92.51,1.47 93.32,2.29 95.96,2.29 96.77,1.47 98.4,1.47 99.21,2.29 103.68,2.29 104.5,1.47 105.31,1.47 106.12,2.29 111.4,2.29 v111.81,1.88 112.22,2.29 119.13,2.29 119.94,1.47 121.56,1.47 122.38,2.29 125.02,2.29 125.83,1.47 127.25,1.47 128.07,2.29 133.35,2.29 134.16,1.47 134.98,1.47 135.79,2.29 141.27,2.29 v141.68,1.88 142.09,2.29 148.79,2.29 149.61,1.47 151.43,1.47 152.25,2.29 155.09,2.29 155.9,1.47 157.12,1.47 157.94,2.29 162.61,2.29 163.42,1.47 164.24,1.47 165.05,2.29 170.54,2.29 v170.94,1.88 171.35,2.29 178.05,2.29 178.87,1.47 180.7,1.47 181.51,2.29 184.76,2.29 185.57,1.47 186.99,1.47 187.81,2.29 191.87,2.29 192.68,1.47 193.5,1.47 194.31,2.29 200.2,2.29 v200.61,1.88 201.02,2.29 208.13,2.29 208.33,2.08 210.36,2.08 211.38,3.1 213.82,3.1 214.22,3.51 222.15,3.51 222.55,3.91 229.46,3.91 230.26,4.71 D1.2
  Bottom 0.254: D29.2 25.28,4.97 D29.2_BOTTOM | D25.2 54.75,4.97 D25.2_BOTTOM | D21.2 84.21,4.97 D21.2_BOTTOM | D17.2 113.42,4.97 D17.2_BOTTOM | D13.2 143.14,4.97 D13.2_BOTTOM | D9.2 172.6,4.97 D9.2_BOTTOM | D5.2 202.07,4.97 D5.2_BOTTOM | D1.2 231.53,4.97 D1.2_BOTTOM
L1_G2_LED  (via drill 0.43)
  Top 0.203: 19.75,5.35 19.76,5.33 19.76,5.07 | 19.76,5.07 v19.76,2.29 18.54,3.51 17.32,3.51 16.65,4.18 D30.2 | D26.2 46.11,2.63 v45.77,2.29 47.4,2.29 48.82,3.71 48.82,4.66 D26.2_TOP | D22.2 75.58,2.35 v75.64,2.29 77.06,2.29 78.28,3.51 78.28,4.66 D22.2_TOP | D18.2 105.04,2.42 v104.9,2.29 106.32,2.29 107.75,3.71 107.75,4.66 D18.2_TOP | D14.2 134.5,2.35 v134.57,2.29 136.19,2.29 137.21,3.3 137.21,4.66 D14.2_TOP | D10.2 163.97,2.42 v163.83,2.29 165.46,2.29 166.67,3.51 166.67,4.66 D10.2_TOP | D6.2 193.43,2.63 v193.09,2.29 195.12,2.29 196.14,3.3 196.14,4.66 D6.2_TOP 200.2,8.73 200.2,14.48 200.81,15.09 208.53,15.09 213.21,19.76 213.21,21.08 JP1.7 | D2.2_TOP 225.81,4.87 225.81,3.91 225.6,3.71 223.57,3.71 222.9,4.38 D2.2 | 19.76,5.07 D30.2_TOP
  Bottom 0.203: v19.76,2.29 20.17,2.69 30.94,2.69 31.75,1.88 32.97,1.88 33.78,2.69 37.64,2.69 38.46,1.88 39.27,1.88 40.08,2.69 45.36,2.69 v45.77,2.29 46.18,2.69 60.6,2.69 61.42,1.88 62.84,1.88 63.65,2.69 67.11,2.69 67.92,1.88 68.73,1.88 69.54,2.69 75.23,2.69 v75.64,2.29 76.05,2.69 90.27,2.69 91.08,1.88 92.3,1.88 93.12,2.69 96.16,2.69 96.98,1.88 98.2,1.88 99.01,2.69 104.5,2.69 v104.9,2.29 105.31,2.69 119.33,2.69 120.14,1.88 121.36,1.88 122.17,2.69 125.42,2.69 126.24,1.88 127.05,1.88 127.86,2.69 134.16,2.69 v134.57,2.29 134.98,2.69 149,2.69 149.81,1.88 151.23,1.88 152.04,2.69 155.3,2.69 156.11,1.88 156.92,1.88 157.73,2.69 163.42,2.69 v163.83,2.29 164.24,2.69 178.26,2.69 179.07,1.88 180.49,1.88 181.3,2.69 184.96,2.69 185.78,1.88 186.79,1.88 187.6,2.69 192.68,2.69 v193.09,2.29 193.5,2.69 208.33,2.69 208.53,2.49 210.16,2.49 211.18,3.51 213.61,3.51 214.02,3.91 221.74,3.91 222.8,4.97 D2.2
  Bottom 0.254: D30.2 17.92,4.97 D30.2_BOTTOM | D26.2 47.38,4.97 D26.2_BOTTOM | D22.2 76.85,4.97 D22.2_BOTTOM | D18.2 106.31,4.97 D18.2_BOTTOM | D14.2 135.77,4.97 D14.2_BOTTOM | D10.2 165.24,4.97 D10.2_BOTTOM | D6.2 194.7,4.97 D6.2_BOTTOM | D2.2 224.17,4.97 D2.2_BOTTOM
L1_G3_LED  (via drill 0.43)
  Top 0.203: 12.45,5.13 12.65,4.93 v12.65,2.69 11.84,3.51 10.21,3.51 9.28,4.43 D31.2 | 12.45,5.13 12.38,5.2 | D27.2 38.75,2.81 v38.86,2.69 40.89,2.69 41.3,3.1 41.3,4.51 D27.2_TOP | D23.2 68.21,2.81 v68.33,2.69 70.56,2.69 70.97,3.1 70.97,4.71 D23.2_TOP | D19.2 97.67,2.78 v97.59,2.69 100.02,2.69 100.43,3.1 100.43,4.71 D19.2_TOP | D15.2 126.88,2.93 v126.64,2.69 129.08,2.69 129.49,3.1 129.49,4.56 D15.2_TOP | D11.2 v156.6,2.78 158.84,2.78 159.16,3.1 159.16,4.51 D11.2_TOP | v186.18,2.69 186.07,2.81 D7.2 | D7.2_TOP 189.23,4.99 189.23,3.1 188.82,2.69 v186.18,2.69 | D3.2_TOP 218.08,4.51 218.08,3.91 216.05,3.91 215.53,4.43 D3.2 | v198.17,8.38 199.8,10.01 199.8,14.68 200.61,15.49 208.13,15.49 211.99,19.35 211.99,22.4 JP1.6 | v198.98,5.13 198.98,4.72 195.53,1.27 187.6,1.27 v186.18,2.69 | D31.2_TOP 12.45,5.12 12.45,5.13
  Bottom 0.203: v12.65,2.69 13.06,3.1 31.14,3.1 31.95,2.29 32.77,2.29 33.58,3.1 38.46,3.1 v38.86,2.69 39.27,3.1 60.81,3.1 61.62,2.29 62.64,2.29 63.45,3.1 67.92,3.1 v68.33,2.69 68.73,3.1 90.47,3.1 91.29,2.29 92.1,2.29 92.91,3.1 97.18,3.1 v97.59,2.69 97.99,3.1 119.53,3.1 120.34,2.29 121.16,2.29 121.97,3.1 126.24,3.1 v126.64,2.69 127.05,3.1 149.2,3.1 150.01,2.29 151.03,2.29 151.84,3.1 156.11,3.1 156.51,2.69 v156.6,2.78 156.92,3.1 178.46,3.1 179.27,2.29 180.29,2.29 181.1,3.1 185.78,3.1 v186.18,2.69 186.59,3.1 208.53,3.1 208.74,2.9 209.96,2.9 210.97,3.91 213.41,3.91 214.47,4.97 D3.2 | v198.17,8.38 198.17,5.94 v198.98,5.13
  Bottom 0.254: D31.2 10.55,4.97 D31.2_BOTTOM | D27.2 40.02,4.97 D27.2_BOTTOM | D23.2 69.48,4.97 D23.2_BOTTOM | D19.2 98.94,4.97 D19.2_BOTTOM | D15.2 128.15,4.97 D15.2_BOTTOM | D11.2 157.87,4.97 D11.2_BOTTOM | D7.2 187.34,4.97 D7.2_BOTTOM | D3.2 216.8,4.97 D3.2_BOTTOM
L1_G4_LED  (via drill 0.43)
  Top 0.203: D32.2_TOP 5.33,4.74 5.33,2.69 4.93,2.29 3.5,2.29 1.92,3.88 D32.2 | D28.2_TOP 33.98,4.56 33.98,3.1 33.17,2.29 31.75,2.29 31.38,2.66 D28.2 | D24.2_TOP 63.65,4.76 63.65,2.9 62.84,2.08 61.21,2.08 60.84,2.45 D24.2 | D20.2_TOP 92.91,4.56 92.91,2.9 92.3,2.29 91.29,2.29 90.31,3.27 D20.2 | D16.2_TOP 122.17,4.61 122.17,3.3 121.16,2.29 120.34,2.29 119.52,3.11 D16.2 | D12.2_TOP 152.04,4.76 152.04,3.1 151.23,2.29 149.81,2.29 149.24,2.86 D12.2 | D8.2_TOP 181.71,4.99 181.71,3.1 180.9,2.29 179.27,2.29 178.7,2.86 D8.2 | D4.2_TOP 210.77,4.56 210.77,3.3 210.36,2.9 208.74,2.9 208.16,3.47 D4.2 | v191.67,5.94 192.89,7.16 192.89,12.65 192.28,13.26 192.28,14.68 193.5,15.9 207.72,15.9 210.57,18.75 210.57,20.98 JP1.5
  Bottom 0.203: 209.43,4.97 208.37,3.91 191.67,3.91 | 191.67,3.91 180.7,3.91 | 180.7,3.91 180.05,4.56 D8.2_BOTTOM | 180.7,3.91 151.23,3.91 | 151.23,3.91 150.59,4.56 D12.2_BOTTOM | 151.23,3.91 121.56,3.91 | 121.56,3.91 120.87,4.61 D16.2_BOTTOM | 121.56,3.91 92.51,3.91 | 92.51,3.91 91.66,4.76 D20.2_BOTTOM | 92.51,3.91 62.64,3.91 | 62.64,3.91 62.19,4.35 D24.2_BOTTOM | 62.64,3.91 32.97,3.91 | 32.97,3.91 32.77,4.11 32.77,5.02 D28.2_BOTTOM | 32.97,3.91 3.71,3.91 3.5,4.11 3.5,4.82 D32.2_BOTTOM | v191.67,5.94 191.67,3.91
  Bottom 0.254: D32.2 3.19,4.97 D32.2_BOTTOM | D28.2 32.65,4.97 D28.2_BOTTOM | D24.2 62.11,4.97 D24.2_BOTTOM | D20.2 91.58,4.97 D20.2_BOTTOM | D16.2 120.79,4.97 D16.2_BOTTOM | D12.2 150.51,4.97 D12.2_BOTTOM | D8.2 179.97,5 D8.2_BOTTOM | D4.2 209.43,4.97 D4.2_BOTTOM
L1_R1_LED  (via drill 0.43)  (1 unrouted)
  Top 0.203: D29.1 23.82,6.83 23.82,9.19 26.06,11.43 v26.06,13.46 | v53.7,13.87 53.81,13.75 D25.1 | v82.75,13.87 83.28,13.34 D21.1 | v112.62,13.87 112.01,13.26 112.01,7.16 112.49,6.69 D17.1 | v141.88,13.87 142.21,13.55 D13.1 | v171.75,13.87 171.35,13.46 171.35,7.37 171.67,7.04 D9.1 | v201.02,13.87 201.13,13.75 D5.1
  Top 0.254: D29.1 24.35,6.07 D29.1_TOP | D25.1 53.81,6.07 D25.1_TOP | D21.1 83.28,6.07 D21.1_TOP | D17.1 112.49,6.07 D17.1_TOP | D13.1 142.21,6.07 D13.1_TOP | D9.1 171.67,6.07 D9.1_TOP | D5.1 201.13,6.07 D5.1_TOP | D1.1 230.6,6.07 D1.1_TOP
  Bottom 0.203: D29.1_BOTTOM 25.87,6.3 D29.1 | D25.1_BOTTOM 55.33,6.3 D25.1 | D21.1_BOTTOM 84.79,6.3 D21.1 | D17.1_BOTTOM 114,6.3 D17.1 | D13.1_BOTTOM 143.72,6.3 D13.1 | D9.1_BOTTOM 173.19,6.3 D9.1 | D5.1_BOTTOM 202.65,6.3 D5.1 | D1.1 232.11,6.3 D1.1_BOTTOM 233.45,5.05 234.95,6.55 234.95,9.6 232.71,11.84 225.2,11.84 224.38,12.65 223.37,12.65 222.15,13.87 220.12,13.87 219.3,13.06 217.47,13.06 216.26,14.27 215.04,14.27 214.22,13.46 213,13.46 | v26.06,13.46 26.47,13.06 29.31,13.06 30.53,14.27 32.16,14.27 32.97,13.46 37.64,13.46 38.46,14.27 39.67,14.27 40.49,13.46 42.11,13.46 42.93,14.27 46.79,14.27 47.6,13.46 49.83,13.46 50.65,14.27 52.68,14.27 53.09,13.87 v53.7,13.87 54.1,13.46 55.32,13.46 56.13,14.27 57.76,14.27 58.57,13.46 66.9,13.46 67.72,14.27 68.94,14.27 69.75,13.46 71.17,13.46 71.98,14.27 75.84,14.27 76.66,13.46 78.89,13.46 79.7,14.27 81.74,14.27 82.14,13.87 v82.75,13.87 83.16,13.46 84.58,13.46 85.39,14.27 87.22,14.27 88.04,13.46 95.76,13.46 96.57,14.27 97.79,14.27 98.6,13.46 101.24,13.46 102.06,14.27 105.71,14.27 106.53,13.46 108.76,13.46 109.58,14.27 111.61,14.27 112.01,13.87 112.42,13.87 | 112.42,13.87 v112.62,13.87 | 112.42,13.87 112.83,13.46 113.64,13.46 114.45,14.27 116.08,14.27 116.89,13.46 125.63,13.46 126.44,14.27 127.66,14.27 128.47,13.46 130.3,13.46 131.11,14.27 134.98,14.27 135.79,13.46 138.02,13.46 138.84,14.27 140.87,14.27 141.27,13.87 v141.88,13.87 142.29,13.46 143.51,13.46 144.32,14.27 145.95,14.27 146.76,13.46 154.89,13.46 155.7,14.27 156.92,14.27 157.73,13.46 160.38,13.46 161.19,14.27 165.05,14.27 165.86,13.46 167.89,13.46 168.71,14.27 170.74,14.27 171.14,13.87 v171.75,13.87 172.16,13.46 172.77,13.46 173.79,14.48 175.62,14.48 176.63,13.46 184.15,13.46 184.96,14.27 186.18,14.27 186.99,13.46 189.64,13.46 190.45,14.27 194.11,14.27 194.92,13.46 197.15,13.46 197.97,14.27 200,14.27 200.41,13.87 v201.02,13.87 201.42,13.46 204.88,13.46 205.69,14.27 207.31,14.27 208.13,13.46 213,13.46
  Bottom 0.203: 213.61,14.27 213.61,14.07 213,13.46
L1_R2_LED  (via drill 0.43)  (1 unrouted)
  Top 0.203: 16.98,6.07 16.51,6.54 16.51,9.4 18.14,11.02 v18.14,13.06 | v46.18,13.46 46.45,13.19 D26.1 | v75.44,13.46 75.91,12.99 D22.1 | v105.31,13.46 105.38,13.39 D18.1 | v134.57,13.46 134.84,13.19 D14.1 | v164.64,13.46 164.3,13.19 D10.1 | v193.7,13.46 193.77,13.39 D6.1 | v223.77,11.84 222.55,10.62 222.55,6.55 | 222.55,6.55 222.81,6.3 D2.1 | 208.13,10.62 208.13,7.98 206.91,6.76 206.91,3.3 208.33,1.88 211.38,1.88 212.8,3.3 219.3,3.3 222.55,6.55
  Top 0.254: D30.1 16.98,6.07 D30.1_TOP | D26.1 46.45,6.07 D26.1_TOP | D22.1 75.91,6.07 D22.1_TOP | D18.1 105.38,6.07 D18.1_TOP | D14.1 134.84,6.07 D14.1_TOP | D10.1 164.3,6.07 D10.1_TOP | D6.1 193.77,6.07 D6.1_TOP | D2.1 223.23,6.07 D2.1_TOP
  Bottom 0.203: D30.1_BOTTOM 18.5,6.3 D30.1 | D26.1_BOTTOM 47.96,6.3 D26.1 | D22.1_BOTTOM 77.43,6.3 D22.1 | D18.1_BOTTOM 106.89,6.3 D18.1 | D14.1_BOTTOM 136.36,6.3 D14.1 | D10.1_BOTTOM 165.82,6.3 D10.1 | D6.1_BOTTOM 195.28,6.3 D6.1 | D2.1_BOTTOM 224.75,6.3 D2.1 | v18.14,13.06 18.95,12.24 20.78,12.24 22,13.46 23.42,13.46 24.23,12.65 29.51,12.65 30.73,13.87 31.95,13.87 32.77,13.06 37.85,13.06 38.66,13.87 39.47,13.87 40.28,13.06 42.32,13.06 43.13,13.87 45.16,13.87 45.57,13.46 v46.18,13.46 46.58,13.06 50.04,13.06 50.85,13.87 52.48,13.87 53.29,13.06 55.52,13.06 56.34,13.87 57.56,13.87 58.37,13.06 67.11,13.06 67.92,13.87 68.73,13.87 69.54,13.06 71.37,13.06 72.19,13.87 74.62,13.87 75.03,13.46 v75.44,13.46 75.84,13.06 79.1,13.06 79.91,13.87 81.53,13.87 82.35,13.06 84.78,13.06 85.6,13.87 87.02,13.87 87.83,13.06 95.96,13.06 96.77,13.87 97.59,13.87 98.4,13.06 101.45,13.06 102.26,13.87 104.29,13.87 104.7,13.46 v105.31,13.46 105.71,13.06 108.97,13.06 109.78,13.87 111.4,13.87 112.22,13.06 113.84,13.06 114.66,13.87 115.87,13.87 116.69,13.06 125.83,13.06 126.64,13.87 127.46,13.87 128.27,13.06 130.5,13.06 131.32,13.87 133.35,13.87 133.76,13.46 v134.57,13.46 134.98,13.06 138.23,13.06 139.04,13.87 140.66,13.87 141.48,13.06 143.71,13.06 144.53,13.87 145.74,13.87 146.56,13.06 155.09,13.06 155.9,13.87 156.72,13.87 157.53,13.06 160.58,13.06 161.39,13.87 163.42,13.87 163.83,13.46 v164.64,13.46 165.05,13.06 168.1,13.06 168.91,13.87 170.54,13.87 171.35,13.06 172.97,13.06 173.99,14.07 175.41,14.07 176.43,13.06 184.35,13.06 185.17,13.87 185.98,13.87 186.79,13.06 189.84,13.06 190.65,13.87 192.68,13.87 193.09,13.46 193.5,13.46
  Bottom 0.203: 193.5,13.46 v193.7,13.46 | 193.5,13.46 193.9,13.06 197.36,13.06 198.17,13.87 199.8,13.87 200.61,13.06 205.08,13.06 205.89,13.87 207.11,13.87 207.92,13.06 214.43,13.06 215.24,13.87 216.05,13.87 217.27,12.65 219.51,12.65 220.32,13.46 221.94,13.46 223.57,11.84 v223.77,11.84
L1_R3_LED  (via drill 0.43)  (1 unrouted)
  Top 0.203: D31.1 9.4,6.52 9.4,9.4 11.43,11.43 v11.43,11.84 | v39.06,13.06 39.08,13.04 D27.1 | v68.33,13.06 68.55,12.83 D23.1 | v97.18,13.06 98.01,12.23 D19.1 | v127.05,13.06 127.22,12.89 D15.1 | v156.31,13.06 156.94,12.43 D11.1 | v185.57,13.06 186.4,12.23 D7.1 | v215.65,13.06 215.87,12.83 D3.1 215.71,6.15 215.04,6.15 211.18,2.29 208.53,2.29 207.31,3.51 207.31,6.55 208.53,7.77 208.53,10.41
  Top 0.254: D31.1 9.62,6.07 D31.1_TOP | D27.1 39.08,6.07 D27.1_TOP | D23.1 68.55,6.07 D23.1_TOP | D19.1 98.01,6.07 D19.1_TOP | D15.1 127.22,6.07 D15.1_TOP | D11.1 156.94,6.07 D11.1_TOP | D7.1 186.4,6.07 D7.1_TOP | D3.1 215.87,6.07 D3.1_TOP
  Bottom 0.203: D31.1_BOTTOM 11.13,6.3 D31.1 | D27.1_BOTTOM 40.6,6.3 D27.1 | D23.1_BOTTOM 70.06,6.3 D23.1 | D19.1_BOTTOM 99.53,6.3 D19.1 | D15.1_BOTTOM 128.74,6.3 D15.1 | D11.1_BOTTOM 158.45,6.3 D11.1 | D7.1_BOTTOM 187.92,6.3 D7.1 | D3.1_BOTTOM 217.38,6.3 D3.1 | v11.43,11.84 11.84,11.43 13.46,11.43 13.66,11.63 13.66,12.24 14.07,12.65 14.88,12.65 15.7,11.84 20.98,11.84 22.2,13.06 23.22,13.06 24.03,12.24 29.72,12.24 30.94,13.46 31.75,13.46 32.56,12.65 38.66,12.65 v39.06,13.06 39.47,12.65 42.52,12.65 43.33,13.46 44.96,13.46 45.77,12.65 50.24,12.65 51.05,13.46 52.27,13.46 53.09,12.65 55.73,12.65 56.54,13.46 57.35,13.46 58.17,12.65 67.92,12.65 v68.33,13.06 68.73,12.65 71.58,12.65 72.39,13.46 74.22,13.46 75.03,12.65 79.3,12.65 80.11,13.46 81.33,13.46 82.14,12.65 84.99,12.65 85.8,13.46 86.82,13.46 87.63,12.65 96.77,12.65 v97.18,13.06 97.59,12.65 101.65,12.65 102.46,13.46 104.09,13.46 104.9,12.65 109.17,12.65 109.98,13.46 111.2,13.46 112.01,12.65 114.05,12.65 114.86,13.46 115.67,13.46 116.48,12.65 126.64,12.65 v127.05,13.06 127.46,12.65 130.71,12.65 131.52,13.46 133.15,13.46 133.96,12.65 138.43,12.65 139.24,13.46 140.46,13.46 141.27,12.65 143.92,12.65 144.73,13.46 145.54,13.46 146.35,12.65 155.9,12.65 v156.31,13.06 156.72,12.65 160.78,12.65 161.59,13.46 163.22,13.46 164.03,12.65 168.3,12.65 169.11,13.46 170.33,13.46 171.14,12.65 173.18,12.65 174.19,13.67 175.21,13.67 176.22,12.65 185.17,12.65 v185.57,13.06 185.98,12.65 190.04,12.65 190.86,13.46 192.48,13.46 193.29,12.65 197.56,12.65 198.37,13.46 199.59,13.46 200.41,12.65 205.28,12.65 206.1,13.46 206.91,13.46 207.72,12.65 215.24,12.65 v215.65,13.06
L1_R4_LED  (via drill 0.43)  (1 unrouted)
  Top 0.203: 2.94,5.38 4.11,4.21 v4.11,3.1 | v32.36,3.1 32.73,3.47 D28.1_TOP | v62.03,3.1 62.19,3.27 D24.1_TOP | v91.69,3.1 91.66,3.14 D20.1_TOP | v120.75,3.1 120.87,3.21 D16.1_TOP | v150.42,3.1 150.59,3.27 D12.1_TOP | v179.88,3.1 180.05,3.27 D8.1_TOP | v209.35,3.71 209.51,4.08 D4.1_TOP | 207.72,10.82 207.72,8.99 v207.11,8.38
  Top 0.254: D32.1 2.25,6.07 2.94,5.38 D32.1_TOP | D28.1 31.72,6.07 D28.1_TOP | D24.1 61.18,6.07 D24.1_TOP | D20.1 90.64,6.07 D20.1_TOP | D16.1 119.85,6.07 D16.1_TOP | D12.1 149.57,6.07 D12.1_TOP | D8.1 179.04,6.09 D8.1_TOP | D4.1 208.5,6.07 D4.1_TOP
  Bottom 0.203: D32.1_BOTTOM 3.77,6.3 D32.1 | D28.1_BOTTOM 33.23,6.3 D28.1 | D24.1_BOTTOM 62.7,6.3 D24.1 | D20.1_BOTTOM 92.16,6.3 D20.1 | D16.1_BOTTOM 121.37,6.3 D16.1 | D12.1_BOTTOM 151.09,6.3 D12.1 | D8.1_BOTTOM 180.55,6.33 D8.1 | D4.1_BOTTOM 210.02,6.3 D4.1 207.11,7.69 v207.11,8.38 | v4.11,3.1 4.52,3.51 31.95,3.51 v32.36,3.1 32.77,3.51 61.62,3.51 v62.03,3.1 62.43,3.51 91.29,3.51 v91.69,3.1 92.1,3.51 120.34,3.51 v120.75,3.1 121.16,3.51 150.01,3.51 v150.42,3.1 150.82,3.51 179.48,3.51 v179.88,3.1 180.29,3.51 208.74,3.51 208.94,3.71 v209.35,3.71
ROW1_LED
  Top 0.356: D1.4 232.51,11.02 237.79,16.31 237.79,18.14 232.26,23.67 JP1.20
  Top 0.406: D1.4_TOP 231.61,8.95 D1.4 | D2.4_TOP 224.25,8.95 D2.4 | D3.4_TOP 216.88,8.95 D3.4 | D4.4_TOP 209.51,8.95 D4.4
  Bottom 0.406: D1.4_BOTTOM 233.36,9 D1.4 229.67,9.8 229.26,9.4 225.6,9.4 D2.4 | D2.4_BOTTOM 226,9 D2.4 | D3.4_BOTTOM 218.63,9 D3.4 | D4.4_BOTTOM 211.26,9 D4.4 D3.4 | D2.4 D3.4 | D2.4
  pour Bottom (no thermals): 206.5,14.88 235.56,14.88 235.56,2.08 206.5,2.08 206.5,14.68
  pour Top (no thermals): 206.5,2.08 206.5,14.88 235.56,14.88 235.56,2.08
ROW2_LED  (via drill 0.6)
  Top 0.406: D5.4_TOP 202.15,8.95 D5.4 203.05,13.46 v203.86,14.27 | D6.4_TOP 194.78,8.95 D6.4 | D7.4_TOP 187.42,8.95 D7.4 | D8.4_TOP 180.05,8.98 D8.4
  Bottom 0.356: v203.86,14.27 204.27,14.27 205.08,15.09 223.16,15.09 228.45,20.37 228.45,21.08 JP1.19
  Bottom 0.406: D5.4_BOTTOM 203.9,9 D5.4 D6.4 | D6.4_BOTTOM 196.53,9 D6.4 | D7.4_BOTTOM 189.17,9 D7.4 | D8.4_BOTTOM 181.8,9.03 181.1,9.73 | 181.1,9.73 D8.4 | 181.1,9.73 188.19,9.73 D7.4 | D6.4 D7.4
  pour Bottom (no thermals): 176.83,14.88 205.89,14.88 205.89,2.08 176.83,2.08 176.83,14.68
  pour Top (no thermals): 177.24,2.08 177.24,14.88 205.89,14.88 205.89,2.08
ROW3_LED  (via drill 0.6)
  Top 0.356: D9.4 173.58,14.48 v178.26,14.48
  Top 0.406: D9.4_TOP 172.68,8.95 D9.4 | D10.4_TOP 165.32,8.95 D10.4 | D11.4_TOP 157.95,8.95 D11.4 | D12.4_TOP 150.59,8.95 D12.4
  Bottom 0.356: v178.26,14.48 178.87,14.48 180.09,15.7 222.55,15.7 227.23,20.37 227.23,22.4 JP1.18
  Bottom 0.406: D9.4_BOTTOM 174.43,9 D9.4 D10.4 | D10.4_BOTTOM 167.07,9 D10.4 | D11.4_BOTTOM 159.7,9 D11.4 | D12.4_BOTTOM 152.34,9 D12.4 D11.4 | D10.4 D11.4
  pour Bottom (no thermals): 147.37,14.88 176.43,14.88 176.43,2.08 147.37,2.08 147.37,14.68
  pour Top (no thermals): 147.78,2.08 147.78,14.88 176.43,14.88 176.43,2.08
ROW4_LED  (via drill 0.6)
  Top 0.356: D13.4 144.12,13.06 145.14,14.07 152.94,14.07 154.02,15.15 159.91,15.15 v159.97,15.09
  Top 0.406: D13.4_TOP 143.22,8.95 D13.4 | D14.4_TOP 135.85,8.95 D14.4 | D15.4_TOP 128.23,8.95 D15.4 | D16.4_TOP 120.87,8.95 D16.4
  Bottom 0.356: v159.97,15.09 161.39,15.09 161.8,15.49 178.87,15.49 179.68,16.31 222.15,16.31 226.01,20.17 226.01,21.08 JP1.17
  Bottom 0.406: D13.4_BOTTOM 144.97,9 D13.4 D14.4 | D14.4_BOTTOM 137.6,9 D14.4 | D15.4_BOTTOM 129.98,9 D15.4 | D16.4_BOTTOM 122.62,9 D16.4 D15.4 | D14.4 D15.4
  pour Bottom (no thermals): 117.91,14.88 146.96,14.88 146.96,2.08 117.91,2.08 117.91,14.68
  pour Top (no thermals): 118.11,2.08 118.11,14.88 146.96,14.88 146.96,2.08
ROW5_LED  (via drill 0.6)
  Top 0.356: D17.4 114.4,13.21 116.08,14.88 145.43,14.88 146.6,16.06 152.81,16.06 v152.86,16.1
  Top 0.406: D17.4_TOP 113.5,8.95 D17.4 | D18.4_TOP 106.39,8.95 D18.4 | D19.4_TOP 99.02,8.95 D19.4 | D20.4_TOP 91.66,8.95 D20.4
  Bottom 0.356: v152.86,16.1 178.46,16.1 179.27,16.92 221.54,16.92 224.79,20.17 224.79,22.3 JP1.16
  Bottom 0.406: D17.4_BOTTOM 115.25,9 D17.4 D18.4 | D18.4_BOTTOM 108.14,9 D18.4 | D19.4_BOTTOM 100.77,9 D19.4 | D20.4_BOTTOM 93.41,9 D20.4 D19.4 | D18.4 D19.4
  pour Bottom (no thermals): 88.44,14.88 117.5,14.88 117.5,2.08 88.44,2.08 88.44,14.68
  pour Top (no thermals): 88.65,2.08 88.65,14.88 117.5,14.88 117.5,2.08
ROW6_LED  (via drill 0.6)
  Top 0.356: D21.4 85.19,13.67 87.02,15.49 144.31,15.49 v146.28,17.47 146.3,17.47
  Top 0.406: D21.4_TOP 84.29,8.95 D21.4 | D22.4_TOP 76.93,8.95 D22.4 | D23.4_TOP 69.56,8.95 D23.4 | D24.4_TOP 62.19,8.95 D24.4
  Bottom 0.356: v146.28,17.47 146.95,18.14 174.8,18.14 176.02,16.92 178.26,16.92 178.87,17.53 221.34,17.53 223.37,19.56 223.37,21.08 JP1.15
  Bottom 0.406: D21.4_BOTTOM 86.04,9 D21.4 D22.4 | D22.4_BOTTOM 78.68,9 D22.4 | D23.4_BOTTOM 71.31,9 D23.4 | D24.4_BOTTOM 63.94,9 D24.4 D23.4 | D22.4 D23.4
  pour Bottom (no thermals): 58.98,14.88 88.04,14.88 88.04,2.08 58.98,2.08 58.98,14.68
  pour Top (no thermals): 59.39,2.08 59.39,14.88 88.04,14.88 88.04,2.08
ROW7_LED  (via drill 0.6)
  Top 0.356: D25.4 55.73,14.48 57.35,16.1 141.56,16.1 v142.99,17.53 v143,17.53
  Top 0.406: D25.4_TOP 54.83,8.95 D25.4 | D26.4_TOP 47.46,8.95 D26.4 | D27.4_TOP 40.1,8.95 D27.4 | D28.4_TOP 32.73,8.95 D28.4
  Bottom 0.356: v142.99,17.53 144.21,18.75 175.21,18.75 176.43,17.53 177.85,17.53 178.46,18.14 220.32,18.14 222.15,19.96 222.15,22.4 JP1.14
  Bottom 0.406: D25.4_BOTTOM 56.58,9 D25.4 D26.4 | D26.4_BOTTOM 49.21,9 D26.4 | D27.4_BOTTOM 41.85,9 D27.4 | D28.4_BOTTOM 34.48,9 D28.4 D27.4 | D26.4 D27.4
  pour Bottom (no thermals): 29.51,14.88 58.57,14.88 58.57,2.08 29.51,2.08 29.51,14.68
  pour Top (no thermals): 29.92,2.08 29.92,14.88 58.57,14.88 58.57,2.08
ROW8_LED  (via drill 0.6)
  Top 0.203: 26.26,10.01 D29.4
  Top 0.356: 26.26,10.01 27.89,11.63 27.89,13.46 31.14,16.71 139.63,16.71 v140.48,17.56 140.51,17.53
  Top 0.406: D29.4_TOP 25.36,8.95 D29.4 | D30.4_TOP 18,8.95 D30.4 | D31.4_TOP 10.63,8.95 D31.4 | D32.4_TOP 3.27,8.95 D32.4
  Bottom 0.356: v140.48,17.56 142.28,19.35 175.62,19.35 176.63,18.34 177.65,18.34 178.05,18.75 218.49,18.75 JP1.13
  Bottom 0.406: D29.4_BOTTOM 27.11,9 D29.4 D30.4 | D30.4_BOTTOM 19.75,9 D30.4 | D31.4_BOTTOM 12.38,9 D31.4 | D32.4_BOTTOM 5.02,9 D32.4 D31.4 | D30.4 D31.4
  pour Bottom (no thermals): 1.07,14.88 29.11,14.88 29.11,2.08 1.07,2.08
  pour Top (no thermals): 1.07,2.08 1.07,14.88 29.11,14.88 29.11,2.08